# EAGLE design MicroSD-BoosterPack-RevA1 (EAGLE 6.3)

## Sheet 1 of 2
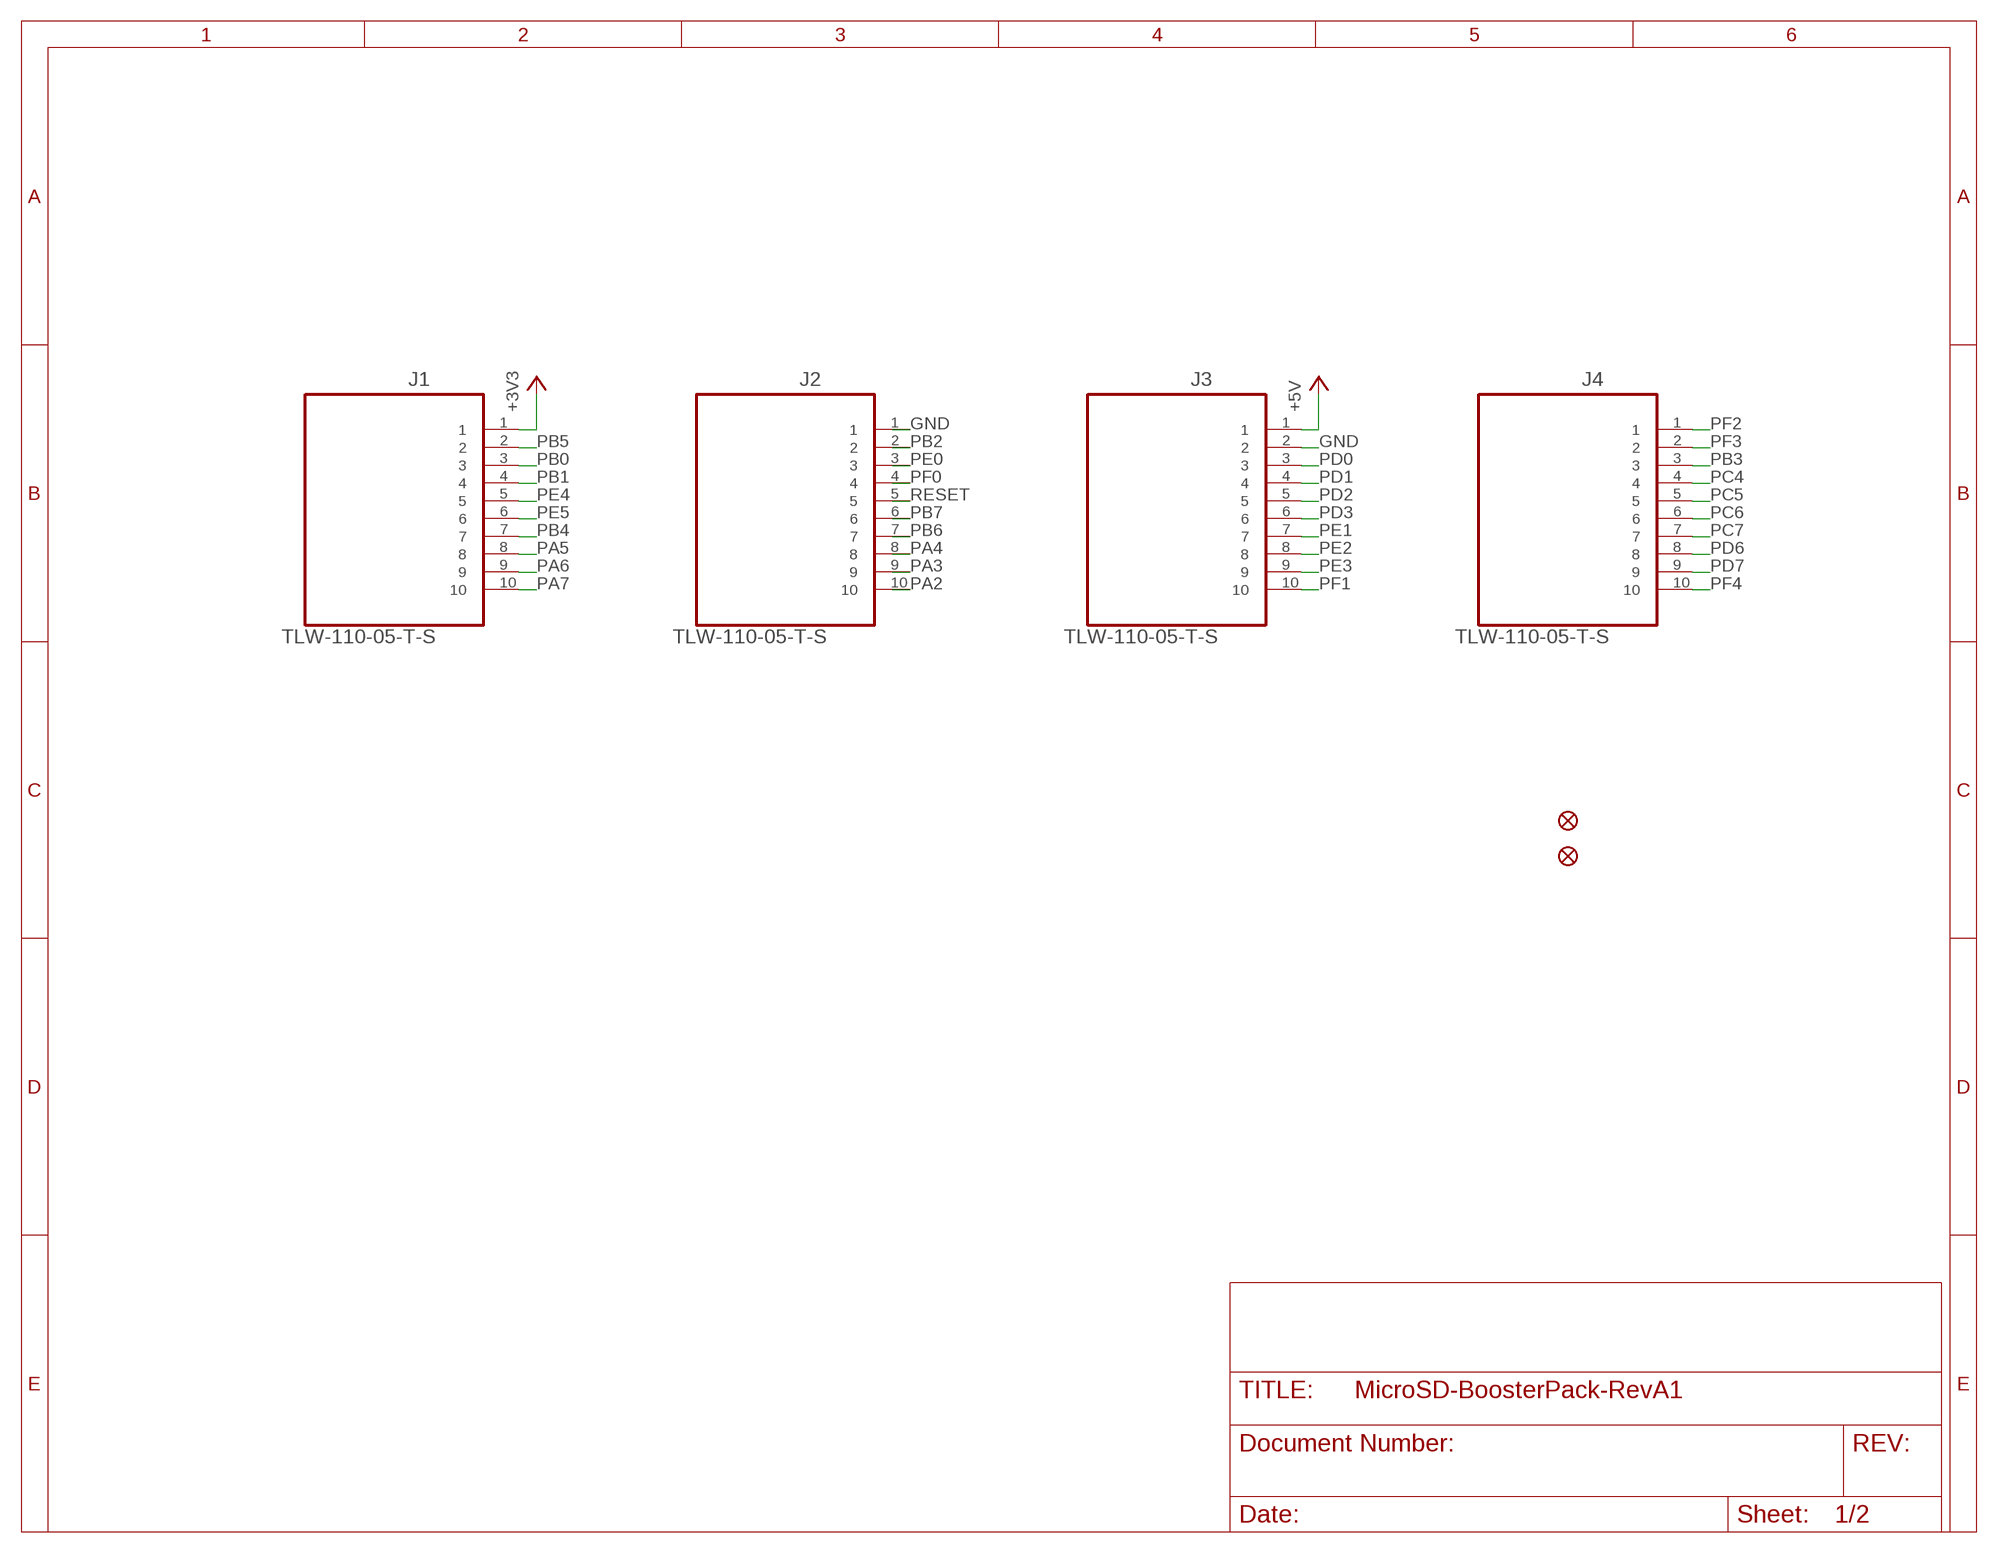
[diagram p0: schematic, sheet 1]

### Parts
FID1  FIDUCIAL1X2  [FIDUCIAL-1X2]
FID2  FIDUCIAL1X2  [FIDUCIAL-1X2]
J1  TLW-110-05-T-S  [SAMTEC_TLW-110-05-T-S]
J2  TLW-110-05-T-S  [SAMTEC_TLW-110-05-T-S]
J3  TLW-110-05-T-S  [SAMTEC_TLW-110-05-T-S]
J4  TLW-110-05-T-S  [SAMTEC_TLW-110-05-T-S]

### Nets
+3V3 [power]: J1.1 ; also sheet 2
+5V [power]: J3.1
GND: J2.1 J3.2 ; also sheet 2
PA2: J2.10 ; also sheet 2
PA3: J2.9 ; also sheet 2
PA4: J2.8 ; also sheet 2
PA5: J1.8 ; also sheet 2
PA6: J1.9 ; also sheet 2
PA7: J1.10 ; also sheet 2
PB0: J1.3
PB1: J1.4
PB2: J2.2
PB3: J4.3
PB4: J1.7 ; also sheet 2
PB5: J1.2
PB6: J2.7 ; also sheet 2
PB7: J2.6 ; also sheet 2
PC4: J4.4
PC5: J4.5
PC6: J4.6
PC7: J4.7
PD0: J3.3
PD1: J3.4
PD2: J3.5
PD3: J3.6
PD6: J4.8
PD7: J4.9
PE0: J2.3 ; also sheet 2
PE1: J3.7
PE2: J3.8
PE3: J3.9
PE4: J1.5 ; also sheet 2
PE5: J1.6
PF0: J2.4
PF1: J3.10
PF2: J4.1
PF3: J4.2
PF4: J4.10
RESET: J2.5

## Sheet 2 of 2
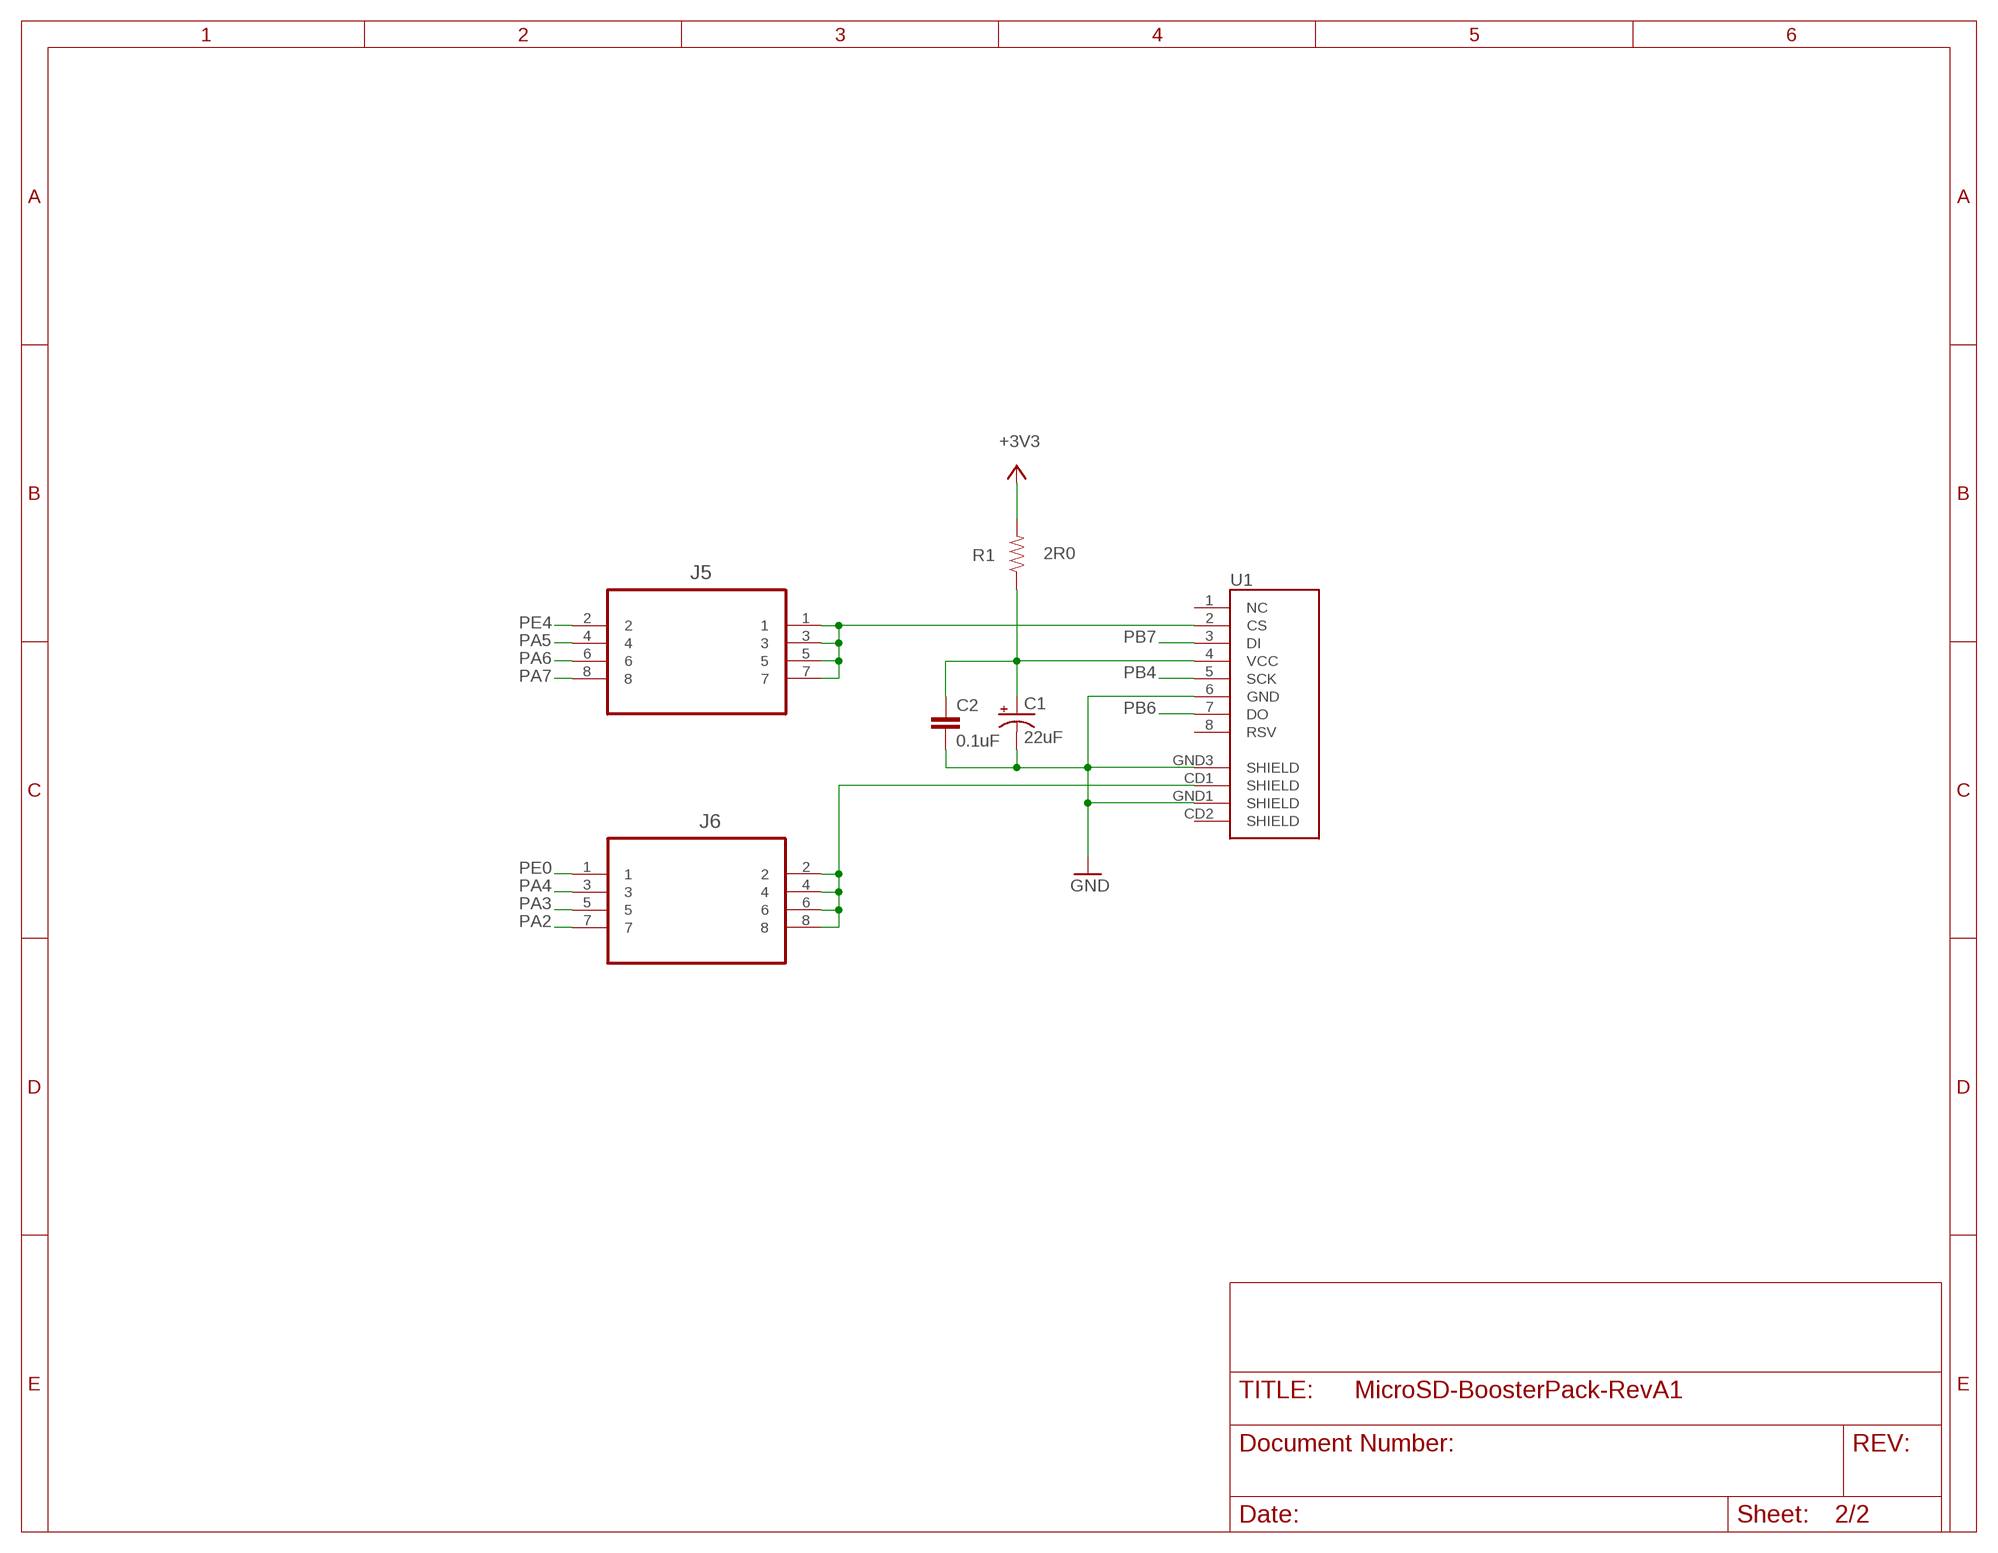
[diagram p1: schematic, sheet 2]

### Parts
C1  22uF  10UF-16V-10%(TANT)  [EIA3216]
C2  0.1uF  CAP0603-CAP  [0603-CAP]
J5  SLW-104-01-T-D  [SAMTEC_SLW-104-01-T-D]
J6  SLW-104-01-T-D  [SAMTEC_SLW-104-01-T-D]
R1  2R0  RESISTOR0603-RES  [0603-RES]
U1  USD-SOCKETNEW  [MICRO-SD-SOCKET-PP]

### Nets
+3V3 [power]: R1.2 ; also sheet 1
+3V3F [power]: C1.A(+) C2.1 R1.1 U1.4(VCC)
GND: C1.C(-) C2.2 U1.6(GND) U1.GND1(SHIELD) U1.GND3(SHIELD) ; also sheet 1
N$1: J6.2 J6.4 J6.6 J6.8 U1.CD1(SHIELD)
N$3: J5.1 J5.3 J5.5 J5.7 U1.2(CS)
PA2: J6.7 ; also sheet 1
PA3: J6.5 ; also sheet 1
PA4: J6.3 ; also sheet 1
PA5: J5.4 ; also sheet 1
PA6: J5.6 ; also sheet 1
PA7: J5.8 ; also sheet 1
PB4: U1.5(SCK) ; also sheet 1
PB6: U1.7(DO) ; also sheet 1
PB7: U1.3(DI) ; also sheet 1
PE0: J6.1 ; also sheet 1
PE4: J5.2 ; also sheet 1
Unconnected: U1.1(NC) U1.8(RSV) U1.CD2(SHIELD)

## Library data of the parts
C1 = SparkFun-Capacitors:10UF-16V-10%(TANT): CAP-00811 1206/EIA-3216 Tantalum capacitor; PROD_ID: CAP-00811; VALUE: 10uF
C2 = SparkFun-Capacitors:CAP: Capacitor Standard 0603 ceramic capacitor, and 0.1" leaded capacitor.
FID1 FID2 = SparkFun-Aesthetics:FIDUCIAL: Fiducial Alignment Points Various fiducial points for machine vision alignment.
J1-J4 = SAMTEC-Txx_By_element14_Batch_1:TLW-110-05-T-S: CONNECTOR HEADER, 10 WAY, 1ROW; MPN: TLW-110-05-T-S; OC_FARNELL: -; OC_NEWARK: 12P0439; PACKAGE: CONN HEADER 10 POS .100 inch; SUPPLIER: SAMTEC
J5 J6 = SAMTEC-BBx-ERx-SLx-SDL_By_element14_Batch_1:SLW-104-01-T-D: LOW PROFILE SOCKET STRIPS, DOUBLE ROW, 8 WAY; MPN: SLW-104-01-T-D; OC_FARNELL: 1803515; OC_NEWARK: 11P6860; PACKAGE: LOW PROFILE SOCKET STRIPS, DOUBLE ROW, 8 WAY; SUPPLIER: SAMTEC
R1 = SparkFun-Resistors:RESISTOR: Resistor Basic schematic elements and footprints for 0603, 1206, and PTH resistors.
U1 = SparkFun-Connectors:USD-SOCKET: microSD Socket Push-push type uSD socket. Schematic element and footprint production proven. Spark Fun Electronics SKU : PRT-00127. tDoc lines correctly indicate media card edge positions when inserting (unlocked, locked, depressed).

## Net classes
1 power: width 0.381 mm

## Board
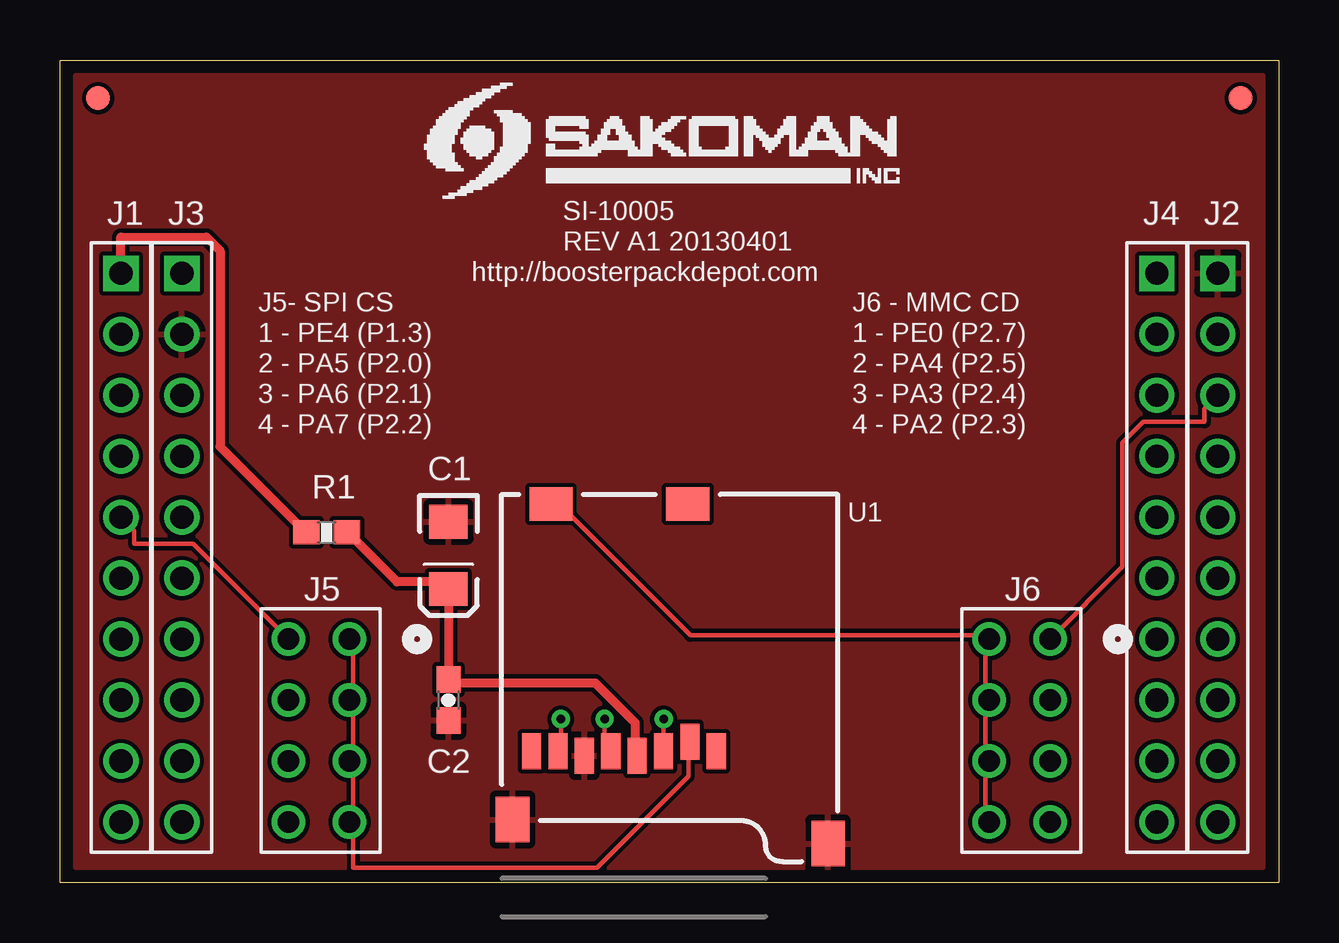
[diagram p2: board, top side]
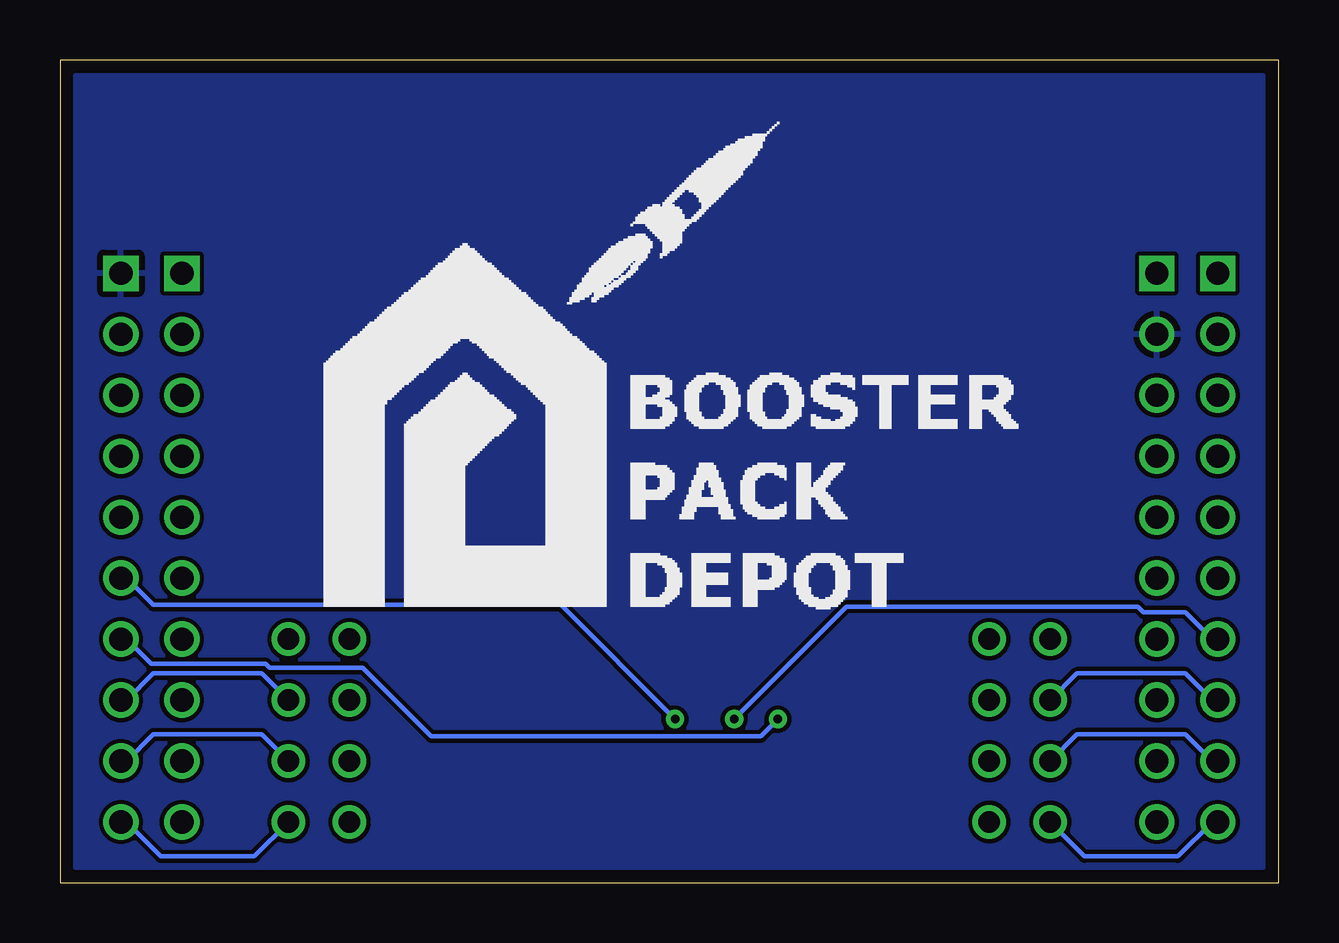
[diagram p3: board, bottom side, seen from below]

Size 50.8 x 34.29 mm. Coordinates in mm from the lower left corner, seen from the top.
Outline: 0,0 0,34.29 50.8,34.29 50.8,0 0,0
Copper layers (1*16): Top 0.0356mm / dielectric 1.5011mm / Bottom 0.0356mm
Design rules "SilverCircuits *": minimum track width 7mil, minimum drill 14mil, track to track 7mil, track to pad 7mil, pad to pad 7mil, via to via 7mil, smd to smd 0mil, copper to edge 20mil, drill to drill 8mil, minimum pad ring 10mil, minimum via ring 8mil, stop-mask expansion 4mil, vias tented up to drill 25mil, thermal gap 10mil

### Footprints (pad centres in the part's own frame; a part is rotated, then mirrored left to right if it is on the bottom)
EIA3216 = smd 1.4 x 1.6: A 1.4,0; C -1.4,0
0603-CAP = smd 1.1 x 1: 1 -0.85,0; 2 0.85,0
FIDUCIAL-1X2 = smd 1 x 1: 1 0,0
SAMTEC_TLW-110-05-T-S = drill 0.965 square: 1 -22.86,0 | drill 0.965: 2 -20.32,0; 3 -17.78,0; 4 -15.24,0; 5 -12.7,0; 6 -10.16,0; 7 -7.62,0; 8 -5.08,0; 9 -2.54,0; 10 0,0
SAMTEC_SLW-104-01-T-D = drill 0.889: 1 -7.62,2.54; 2 -7.62,0; 3 -5.08,2.54; 4 -5.08,0; 5 -2.54,2.54; 6 -2.54,0; 7 0,2.54; 8 0,0
0603-RES = smd 1.1 x 1: 1 -0.85,0; 2 0.85,0
MICRO-SD-SOCKET-PP = smd 0.8 x 1.5: 1 -8.94,10.7; 2 -7.84,10.3; 3 -6.74,10.7; 4 -5.64,10.9; 5 -4.54,10.7; 6 -3.44,10.9; 7 -2.34,10.7; 8 -1.24,10.7 | smd 1.8 x 1.4: CD1 -2.05,0.4; CD2 -7.75,0.4 | smd 1.4 x 1.9: GND1 -13.6,14.55; GND3 -0.45,13.55

### Placement (x,y rotation side)
C1  16.19,13.65 270 top
C2  16.19,7.62 270 top
FID1  1.59,32.7 0 top
FID2  49.21,32.7 0 top
J1  2.54,2.54 270 top
J2  48.26,2.54 270 top
J3  5.08,2.54 270 top
J4  45.72,2.54 270 top
J5  9.53,2.54 270 top
J6  38.73,2.54 270 top
R1  11.11,14.61 180 top
U1  18.41,16.19 180 top

### Tracks (layer width: path | path; a pad name or v marks a point on that pad's centre or on a via)
+3V3
  Top 0.381: J1.1 2.54,26.91 6.11,26.91 6.67,26.35 6.67,18.18 10.24,14.61 R1.2
+3V3F
  Top 0.381: U1.4 24.05,5.32 23.97,5.4 23.97,6.67 22.3,8.33 16.27,8.33 C2.1 C1.A 16.11,12.38 16.11,12.54 14.05,12.54 11.99,14.61 R1.1
GND
  pour Bottom: 0.64,33.66 0.64,0.64 50.16,0.64 50.16,33.66
  pour Top: 0.64,33.66 0.64,0.64 50.16,0.64 50.16,33.66
N$1
  Top 0.178: J6.8 38.58,2.7 38.58,4.92 J6.6 38.73,5.16 38.58,5.32 38.58,7.7 J6.4 38.58,7.78 38.58,10.24 J6.2 38.73,10.32 26.27,10.32 21.27,15.32 21.27,15.72 20.48,15.72 U1.CD1
N$3
  Top 0.178: U1.2 26.19,5.87 26.19,4.45 22.38,0.64 12.22,0.64 12.22,2.38 J5.7 12.22,2.46 12.22,4.92 J5.5 12.22,5 12.22,7.46 J5.3 12.22,7.54 12.22,10 J5.1
PA2
  Bottom 0.178: J6.7 42.7,1.11 46.59,1.11 48.02,2.54 J2.10
PA3
  Bottom 0.178: J6.5 42.39,6.19 46.91,6.19 48.02,5.08 J2.9
PA4
  Bottom 0.178: J6.3 42.39,8.73 46.91,8.73 48.02,7.62 J2.8
PA5
  Bottom 0.178: J5.4 8.41,8.73 3.89,8.73 2.78,7.62 J1.8
PA6
  Bottom 0.178: J5.6 8.41,6.19 3.89,6.19 2.78,5.08 J1.9
PA7
  Bottom 0.178: J5.8 8.1,1.11 4.21,1.11 2.78,2.54 J1.10
PB4  (via drill 0.36)
  Top 0.178: v22.7,6.83 22.7,5.79 22.94,5.56 U1.5
  Bottom 0.178: v22.7,6.83 18.02,11.51 5.87,11.51 5.64,11.27 3.89,11.27 2.78,10.16 J1.7
PB6  (via drill 0.36)
  Top 0.178: v20.88,6.83 20.88,5.64 20.8,5.56 U1.7
  Bottom 0.178: v20.88,6.83 21.59,6.11 35.32,6.11 38.18,8.97 42.07,8.97 42.23,9.13 46.99,9.13 48.02,10.16 J2.7
PB7  (via drill 0.36)
  Top 0.178: v25.16,6.83 25.16,5.56 U1.3
  Bottom 0.178: v25.16,6.83 29.92,11.59 46.91,11.59 48.02,12.7 J2.6
PE0
  Top 0.178: J6.1 44.29,13.18 44.29,18.34 45.16,19.21 47.7,19.21 47.7,19.76 J2.3
PE4
  Top 0.178: J5.2 5.56,14.13 3.1,14.13 3.1,14.68 J1.5

### Text on the board
tPlace: SI-10005 | REV A1 20130401 | http://boosterpackdepot.com | J5- SPI CS | J6 - MMC CD | 1 - PE4 (P1.3) | 1 - PE0 (P2.7) | 2 - PA5 (P2.0) | 2 - PA4 (P2.5) | 3 - PA6 (P2.1) | 3 - PA3 (P2.4) | 4 - PA7 (P2.2) | 4 - PA2 (P2.3)